# Altium schematic sheet PX_PMIC.SchDoc
size A3
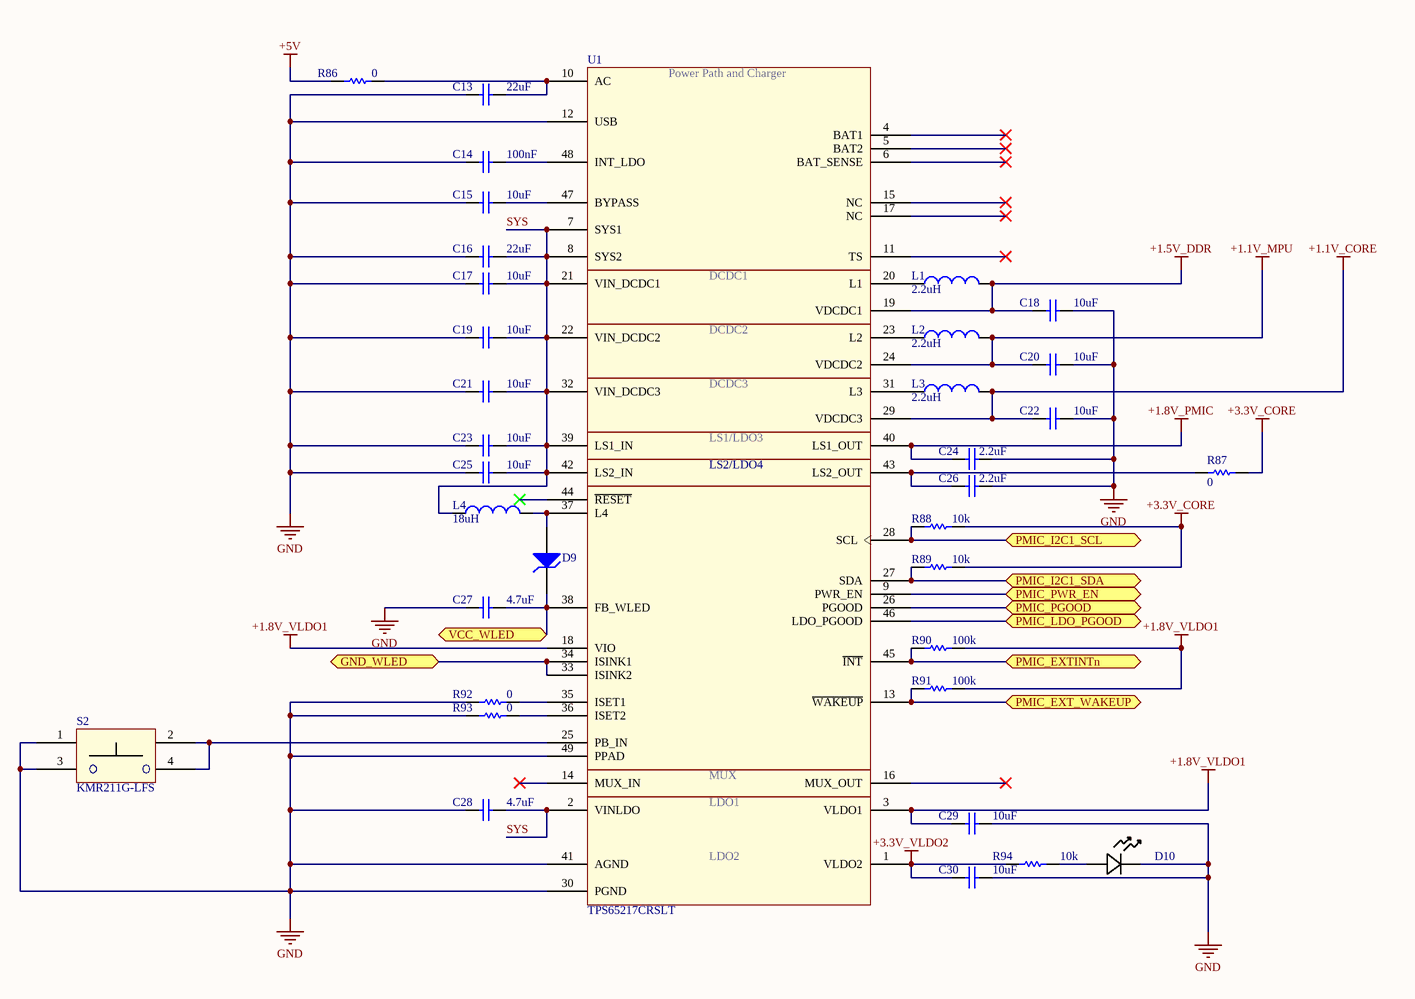
[diagram p0: PX_PMIC.SchDoc]

## Parts
C13  value 22uF  [CAPC1608X08]  (hidden comment: Cap)
C14  value 100nF  [CAPC1608X08]  (hidden comment: Cap)
C15  value 10uF  [CAPC1608X08]  (hidden comment: Cap)
C16  value 22uF  [CAPC1608X08]  (hidden comment: Cap)
C17  value 10uF  [CAPC1608X08]  (hidden comment: Cap)
C18  value 10uF  [CAPC1608X08]  (hidden comment: Cap)
C19  value 10uF  [CAPC1608X08]  (hidden comment: Cap)
C20  value 10uF  [CAPC1608X08]  (hidden comment: Cap)
C21  value 10uF  [CAPC1608X08]  (hidden comment: Cap)
C22  value 10uF  [CAPC1608X08]  (hidden comment: Cap)
C23  value 10uF  [CAPC1608X08]  (hidden comment: Cap)
C24  value 2.2uF  [CAPC1608X08]  (hidden comment: Cap)
C25  value 10uF  [CAPC1608X08]  (hidden comment: Cap)
C26  value 2.2uF  [CAPC1608X08]  (hidden comment: Cap)
C27  value 4.7uF  [CAPC1608X08]  (hidden comment: Cap)
C28  value 4.7uF  [CAPC1608X08]  (hidden comment: Cap)
C29  value 10uF  [CAPC1608X08]  (hidden comment: Cap)
C30  value 10uF  [CAPC1608X08]  (hidden comment: Cap)
D9  D Zener  [MF03A-M]  (value not drawn)
D10  Blanc  [LED_LNJ]  (value not drawn)
L1  value 2.2uH  [INDM1608X08N]  (hidden comment: Inductor)
L2  value 2.2uH  [INDM1608X08N]  (hidden comment: Inductor)
L3  value 2.2uH  [INDM1608X08N]  (hidden comment: Inductor)
L4  value 18uH  [INDM2612X12N]  (hidden comment: Inductor)
R86  value 0  [RESC1608X05]  (hidden comment: Res1)
R87  value 0  [RESC1608X05]  (hidden comment: Res1)
R88  value 10k  [RESC1608X05]  (hidden comment: Res1)
R89  value 10k  [RESC1608X05]  (hidden comment: Res1)
R90  value 100k  [RESC1608X05]  (hidden comment: Res1)
R91  value 100k  [RESC1608X05]  (hidden comment: Res1)
R92  value 0  [RESC1608X05]  (hidden comment: Res1)
R93  value 0  [RESC1608X05]  (hidden comment: Res1)
R94  value 10k  [RESC1608X05]  (hidden comment: Res1)
S2  KMR211G-LFS  [C&K_KMR211G]
U1  TPS65217CRSLT  [CRSLT]

## Ports
GND_WLED, PMIC_EXT_WAKEUP, PMIC_EXTINTn, PMIC_I2C1_SCL, PMIC_I2C1_SDA, PMIC_LDO_PGOOD, PMIC_PGOOD, PMIC_PWR_EN, VCC_WLED

## Nets
+1.1V_CORE: C22.1 L3.2 U1.29(VDCDC3)
+1.1V_MPU: C20.1 L2.2 U1.24(VDCDC2)
+1.5V_DDR: C18.1 L1.2 U1.19(VDCDC1)
+1.8V_PMIC: C24.2 U1.40(LS1_OUT)
+1.8V_VLDO1: C29.1 R90.2 R91.2 U1.3(VLDO1) U1.18(VIO)
+3.3V_CORE: R87.1 R88.2 R89.2
+3.3V_VLDO2: C30.1 R94.1 U1.1(VLDO2)
+5V: R86.1
GND: C13.1 C14.1 C15.1 C16.1 C17.1 C18.2 C19.1 C20.2 C21.1 C22.2 C23.1 C24.1 C25.1 C26.1 C27.1 C28.1 C29.2 C30.2 D10.1 R92.1 R93.1 S2.1 S2.3 U1.12(USB) U1.30(PGND) U1.41(AGND) U1.49(PPAD)
GND_WLED: U1.33(ISINK2) U1.34(ISINK1) ; port GND_WLED
PMIC_EXT_WAKEUP: R91.1 U1.13(~{WAKEUP}) ; port PMIC_EXT_WAKEUP
PMIC_EXTINTn: R90.1 U1.45(~{INT}) ; port PMIC_EXTINTn
PMIC_I2C1_SCL: R88.1 U1.28(SCL) ; port PMIC_I2C1_SCL
PMIC_I2C1_SDA: R89.1 U1.27(SDA) ; port PMIC_I2C1_SDA
PMIC_LDO_PGOOD: U1.46(LDO_PGOOD) ; port PMIC_LDO_PGOOD
PMIC_PGOOD: U1.26(PGOOD) ; port PMIC_PGOOD
PMIC_PWR_EN: U1.9(PWR_EN) ; port PMIC_PWR_EN
SYS: C16.2 C17.2 C19.2 C21.2 C23.2 C25.2 C28.2 L4.1 U1.2(VINLDO) U1.7(SYS1) U1.8(SYS2) U1.21(VIN_DCDC1) U1.22(VIN_DCDC2) U1.32(VIN_DCDC3) U1.39(LS1_IN) U1.42(LS2_IN)
VCC_WLED: C27.2 D9.2(K) U1.38(FB_WLED) ; port VCC_WLED
NetC13_2: C13.2 R86.2 U1.10(AC)
NetC14_2: C14.2 U1.48(INT_LDO)
NetC15_2: C15.2 U1.47(BYPASS)
NetC26_2: C26.2 R87.2 U1.43(LS2_OUT)
NetD9_1: D9.1(A) L4.2 U1.37(L4)
NetD10_2: D10.2 R94.2
NetL1_1: L1.1 U1.20(L1)
NetL2_1: L2.1 U1.23(L2)
NetL3_1: L3.1 U1.31(L3)
NetR92_2: R92.2 U1.35(ISET1)
NetR93_2: R93.2 U1.36(ISET2)
NetS2_2: S2.2 S2.4 U1.25(PB_IN)

Not connected (* = marked no-connect by the designer): U1 4(BAT1)* 5(BAT2)* 6(BAT_SENSE)* 11(TS)* 14(MUX_IN)* 15(NC)* 16(MUX_OUT)* 17(NC)* 44(~{RESET})*

## Notes on the sheet
- (in symbol TPS65217CRSLT) Power Path and Charger; DCDC1; DCDC2; DCDC3; LS1/LDO3; LS2/LDO4; MUX; LDO1; LDO2

## Library data of the parts
C13 C16 = Cap: Capacitor; Fabricant: MURATA; Fournisseur: Farnell; RefFabricant: GRM188R60J226MEA0D; RefFournisseur: 2666490; Case: 0603 [1608 Metric]; DataSheet: http://www.farnell.com/datasheets/1955681.pdf
C14 = Cap: Capacitor; RefFournisseur: 1828902; RefFabricant: GRM188F51E104ZA01D; Fabricant: MURATA; Fournisseur: Farnell; Case: 0603 [1608 Metric]; DataSheet: http://www.farnell.com/datasheets/2048672.pdf
C15 C17-C23 C25 C29 C30 = Cap: Capacitor; Fournisseur: Farnell; RefFournisseur: 2611921; RefFabricant: GRM188R60J106ME47J; Fabricant: MURATA; Case: 0603 [1608 Metric]; DataSheet: http://www.farnell.com/datasheets/2079165.pdf
C24 C26 = Cap: Capacitor; RefFabricant: GRT188R60J225KE13D; Fabricant: MURATA; Fournisseur: Farnell; RefFournisseur: 2672153; Case: 0603 [1608 Metric]; DataSheet: http://www.farnell.com/datasheets/2165952.pdf
C27 C28 = Cap: Capacitor; Fabricant: MURATA; Fournisseur: Farnell; RefFabricant: GRM188R60J475KE19D; RefFournisseur: 2666491; DataSheet: http://www.farnell.com/datasheets/2048798.pdf; Case: 0603 [1608 Metric]
D9 = D Zener: Zener Diode; RefFabricant: LM4041DIM3-1.2; RefFournisseur: 9778349; Fabricant: Texas Instruments; Fournisseur: Farnell; DataSheet: http://www.ti.com/lit/ds/symlink/lm4041-n.pdf
D10 = LNJ037X8ARA: LED Blanc; RefFournisseur: 1908051; Fabricant: PANASONIC ELECTRONIC COMPONENTS; Fournisseur: Farnell; RefFabricant: LNJ037X8ARA; DataSheet: http://www.farnell.com/datasheets/2085723.pdf
L1-L3 = Inductor: Fabricant: MURATA; Fournisseur: Farnell; RefFabricant: LQM18NN2R2K00D; RefFournisseur: 1343118; Case: 0603 [1608 Metric]; DataSheet: http://www.farnell.com/datasheets/66032.pdf
L4 = Inductor: Fabricant: TDK; Fournisseur: Farnell; RefFabricant: MLF2012C180K; RefFournisseur: 1669551; Case: 0805 [2012 Metric]; DataSheet: http://www.farnell.com/datasheets/321059.pdf
R86 R87 R92 R93 = Res1: Resistor; Case: 0603 [1608 Metric]
R88 R89 R94 = Res1: Resistor; Fabricant: TE CONNECTIVITY; Fournisseur: Farnell; RefFabricant: CPF-A-0603B4K7E1; RefFournisseur: 2483933; Case: 0603 [1608 Metric]; DataSheet: http://www.farnell.com/datasheets/1935020.pdf
R90 R91 = Res1: Resistor; Fabricant: TE CONNECTIVITY; Fournisseur: Farnell; RefFabricant: RN73C1J100KBTDF; RefFournisseur: 2687850; Case: 0603 [1608 Metric]; DataSheet: http://www.farnell.com/datasheets/2189072.pdf
S2 = KMR211G-LFS: Commutateur tactile; Fournisseur: Farnell; RefFournisseur: 1437635; RefFabricant: KMR211G LFS; Fabricant: C & K COMPONENTS; DataSheet: http://www.farnell.com/datasheets/2044619.pdf
U1 = TPS65217CRSLT: Gestion d'alimentation PMIC; Fabricant: Texas Instruments; Fournisseur: Farnell; RefFournisseur: 2492485; RefFabricant: TPS65217CRSLT; DataSheet: http://www.ti.com/lit/ds/symlink/tps65217.pdf